# Altium schematic sheet Temp_Measurements.SchDoc
size A4; CompanyName: Technische Hochschule Nürnberg Georg Simon Ohm; Organization: UltraZohm; Address1: Kesslerplatz 12; Address2: 90489 Nürnberg; Address3: GERMANY; SheetNumber: 8; SheetTotal: 9; Website: www.ultrazohm.com
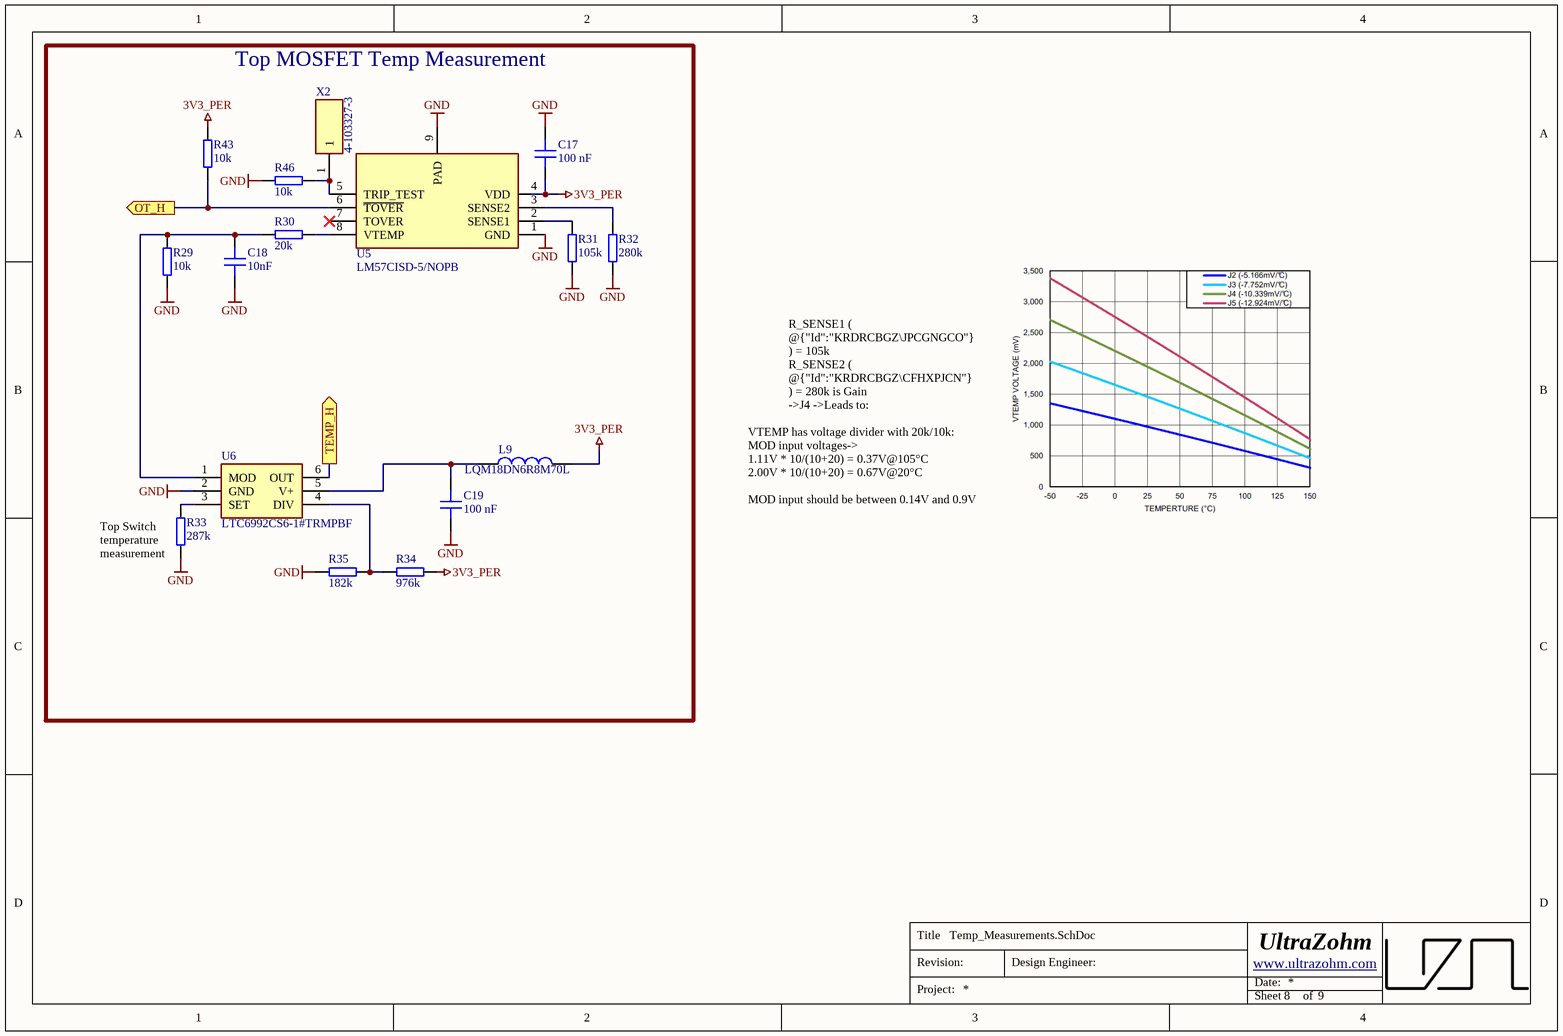
[diagram p0: Temp_Measurements.SchDoc]

## Parts
C17  100 nF  [C_0603]
C18  10nF  [C_0603]
C19  100 nF  [C_0603]
L9  LQM18DN6R8M70L  [INDC1608X95N]
R29  10k  [RES 0603_1608]
R30  20k  [RES 0603_1608]
R31  105k  [RES 0603_1608]
R32  280k  [RES 0603_1608]
R33  287k  [RES 0805_2012]
R34  976k  [RES 0603_1608]
R35  182k  [RES 0603_1608]
R43  10k  [RES 0603_1608]
R46  10k  [RES 0603_1608]
U5  LM57CISD-5/NOPB  [SON50P250X250X80-9N]
U6  LTC6992CS6-1#TRMPBF  [SOT95P280X100-6N]
X2  4-103327-3  [1_Pin_Header]

## Blocks framed on the sheet
Top MOSFET Temp Measurement: C17-C19 L9 R29-R35 R43 R46 U5 U6 X2

## Ports
OT_H (out), TEMP_H (out)

## Nets
3V3_PER: C17.1 L9.2 R34.2 R43.1 U5.4(VDD)
GND: C17.2 C18.1 C19.1 R29.2 R31.1 R32.1 R33.1 R35.1 R46.2 U5.1(GND) U5.9(PAD) U6.2(GND)
OT_H: R43.2 U5.6(~{TOVER}) ; port OT_H
TEMP_H: U6.6(OUT) ; port TEMP_H
NetC18_2: C18.2 R29.1 R30.1 U6.1(MOD)
NetC19_2: C19.2 L9.1 U6.5(V+)
NetR30_2: R30.2 U5.8(VTEMP)
NetR31_2: R31.2 U5.2(SENSE1)
NetR32_2: R32.2 U5.3(SENSE2)
NetR33_2: R33.2 U6.3(SET)
NetR34_1: R34.1 R35.2 U6.4(DIV)
NetR46_1: R46.1 U5.5(TRIP_TEST) X2.1

Not connected (* = marked no-connect by the designer): U5 7(TOVER)*

## Notes on the sheet
- R_SENSE1 ( @{"Id":"KRDRCBGZ\JPCGNGCO"} ) = 105k
  R_SENSE2 ( @{"Id":"KRDRCBGZ\CFHXPJCN"} ) = 280k is Gain
  ->J4 ->Leads to:
  1.11V@105°C
  2.00V@20°C
  /TOVER trips at 105°C
- VTEMP has voltage divider with 20k/10k:
  MOD input voltages->
  1.11V * 10/(10+20) = 0.37V@105°C
  2.00V * 10/(10+20) = 0.67V@20°C
  MOD input should be between 0.14V and 0.9V
- (near R33) Top Switch temperature measurement
- Title
- Revision:
- Design Engineer:
- Date:
- Project:
- Sheet
- of

## Library data of the parts
C17 C19 = C1608X7S2A104KT000N: 100V 100nF X7S ±10% 0603 Multilayer Ceramic Capacitors MLCC - SMD/SMT ROHS; Manufacturer: TDK; Voltage Rating: 100 VDC; Created from: AGeiger; Manufacturer Part Number: C1608X7S2A104KT000N; PartID: 148; Created On: 20.12.2020 13:54:13; ComponentLink1Description: Datasheet; ComponentLink1URL: https://datasheet.lcsc.com/lcsc/2304140030_TDK-C1608X7S2A104KT000N_C343025.pdf; Component Type: Capacitor 0603; Device Package: 0603; Last Updated: 14.12.2022 12:14:21; Mounting Type: SMD; Operating Temperature: -55 to 125°C; Series: X7R; Supplier 1: LCSC; Supplier Part Number 1: C343025; Type: Capacitor; Tolerance: 10 %; Value: 100 nF; Live Cycle Status: 1; Stock number: not stored; LCSC Part Number: C343025
C18 = CT41G-0603-2X1-50V-0.01μF-K(N): 50V 10nF 2X1 ±10%; Manufacturer: TORCH; Voltage Rating: 50 VDC; Created from: KIlhan; Manufacturer Part Number: CT41G-0603-2X1-50V-0.01μF-K(N); PartID: 130; Created On: 05.07.2023 18:57:50; ComponentLink1Description: Datasheet; ComponentLink1URL: https://datasheet.lcsc.com/lcsc/1809291621_TORCH-CT41G-0603-2X1-50V-0-01-F-K-N_C136131.pdf; Component Type: Capacitor 0603; Device Package: 0603; Last Updated: 05.07.2023 18:57:50; Mounting Type: SMD; Operating Temperature: -55 - 125°C; Supplier 1: LCSC; Supplier Part Number 1: C136131; Type: Capacitor; Tolerance: 10 %; Value: 10nF; Live Cycle Status: 1; Stock number: not stored; LCSC Part Number: C136131
L9 = LQM18DN6R8M70L: 6.8µH, 120mA, 0603, 740mOhm, 20%; Manufacturer: Murata; MF: EPCOS / TDK; Value: 6.8uH; DCR: 320m; Rated Current: 0.85 A; Type: fixed inductor; Created from: DHufnagel; MPN: B82464G4154M; Supplier 1: Mouser; Supplier Part Number 1: 81-LQM18DN6R8M70L; Manufacturer Part Number: LQM18DN6R8M70L; PartID: 10; Created On: 19.07.2022 15:47:17; ComponentLink1Description: Datasheet; ComponentLink1URL: https://www.mouser.de/datasheet/2/281/1/JELF243B_0086-2298241.pdf; Component Type: SMD fixed inductor; Device Package: SMD; Last Updated: 15.06.2023 16:03:16; Mounting Type: SMD; Operating Temperature: -40 - 125°C; Series: LQM18DN_70; Supplier 2: Digi-Key; Supplier Part Number 2: 490-LQM18DN6R8M70LCT-ND; DC current: 120mA; Live Cycle Status: 1; Stock number: not stored; LCSC Part Number: C1881372
R29 R43 R46 = RK73B1JTTD103J: SMD resistor E24 series; Manufacturer: KOA Speer; Tolerance: 5%; Created from: MGremer; Manufacturer Part Number: RK73B1JTTD103J; PartID: 98; Created On: 14.12.2020 16:17:14; ComponentLink1Description: Datasheet; ComponentLink1URL: https://www.mouser.de/datasheet/2/219/RK73B-1825463.pdf; Component Type: SMD resistor; Device Package: 0603; Last Updated: 27.05.2022 14:04:22; Mounting Type: SMD; Supplier 1: Mouser; Supplier Part Number 1: 660-RK73B1JTTD103J; Type: Resistor; Value: 10k; Live Cycle Status: 1; Stock number: Labor SMD Container; LCSC Part Number: C25804
R30 = RK73B1JTTD203J: SMD resistor E24 series; Manufacturer: KOA Speer; Tolerance: 5%; Created from: MGremer; Manufacturer Part Number: RK73B1JTTD203J; PartID: 105; Created On: 14.12.2020 16:17:14; ComponentLink1Description: Datasheet; ComponentLink1URL: https://www.mouser.de/datasheet/2/219/RK73B-1825463.pdf; Component Type: SMD resistor; Device Package: 0603; Last Updated: 27.05.2022 13:42:48; Mounting Type: SMD; Supplier 1: Mouser; Supplier Part Number 1: 660-RK73B1JTTD203J; Type: Resistor; Value: 20k; Live Cycle Status: 1; Stock number: Labor SMD Container; LCSC Part Number: C4184
R31 = CR0603-FX-1053ELF: SMD resistor 1%, 50V, 100ppm; Manufacturer: Bourns; Created from: DHufnagel; Manufacturer Part Number: CR0603-FX-1053ELF; PartID: 232; Created On: 25.07.2022 08:26:35; ComponentLink1Description: Datasheet; ComponentLink1URL: https://www.mouser.de/datasheet/2/54/cr-1858361.pdf; Component Type: SMD resistor; Device Package: 0603; Last Updated: 21.02.2024 16:03:36; Mounting Type: SMD; Supplier 1: Mouser; Supplier Part Number 1: 652-CR0603-FX1053ELF; Type: Resistor; Tolerance: 1%; Value: 105k; Live Cycle Status: 1; Stock number: not stored; Supplier 2: LCSC; Supplier Part Number 2: C141685; LCSC Part Number: C141685
R32 = CR0603-FX-2803ELF: SMD resistor 1%, 50V, 100ppm; Manufacturer: Bourns; Created from: DHufnagel; Manufacturer Part Number: CR0603-FX-2803ELF; PartID: 233; Created On: 25.07.2022 08:26:35; ComponentLink1Description: Datasheet; ComponentLink1URL: https://www.mouser.de/datasheet/2/54/cr-1858361.pdf; Component Type: SMD resistor; Device Package: 0603; Last Updated: 21.02.2024 16:06:06; Mounting Type: SMD; Supplier 1: Mouser; Supplier Part Number 1: 652-CR0603-FX2803ELF; Type: Resistor; Tolerance: 1%; Value: 280k; Live Cycle Status: 1; Stock number: not stored; Supplier 2: LCSC; Supplier Part Number 2: C861797; LCSC Part Number: C861797
R33 = ERJ-6ENF2873V: SMD resistor 1%; Manufacturer: Panasonic; Created from: MGremer; Manufacturer Part Number: ERJ-6ENF2873V; PartID: 154; Created On: 14.12.2020 16:17:14; ComponentLink1Description: Datasheet; ComponentLink1URL: https://www.mouser.de/datasheet/2/315/AOA0000C304-1149620.pdf; Component Type: SMD resistor; Device Package: 0805; Last Updated: 15.02.2023 18:07:29; Mounting Type: SMD; Supplier 1: Mouser; Supplier Part Number 1: 667-ERJ-6ENF2873V; Type: Resistor; Tolerance: 1%; Value: 287k; Live Cycle Status: 1; Stock number: not stored; LCSC Part Number: C228683
R34 = CR0603-FX-9763ELF: SMD resistor 1%, 50V, 100ppm; Manufacturer: Bourns; Created from: DHufnagel; Manufacturer Part Number: CR0603-FX-9763ELF; PartID: 234; Created On: 25.07.2022 08:26:35; ComponentLink1Description: Datasheet; ComponentLink1URL: https://www.mouser.de/datasheet/2/54/cr-1858361.pdf; Component Type: SMD resistor; Device Package: 0603; Last Updated: 15.02.2023 18:14:05; Mounting Type: SMD; Supplier 1: Mouser; Supplier Part Number 1: 652-CR0603FX-9763ELF; Type: Resistor; Tolerance: 1%; Value: 976k; Live Cycle Status: 1; Stock number: not stored; LCSC Part Number: C162980
R35 = CR0603-FX-1823ELF: SMD resistor 1%, 50V, 100ppm; Manufacturer: Bourns; Created from: DHufnagel; Manufacturer Part Number: CR0603-FX-1823ELF; PartID: 235; Created On: 25.07.2022 08:26:35; ComponentLink1Description: Datasheet; ComponentLink1URL: https://www.mouser.de/datasheet/2/54/cr-1858361.pdf; Component Type: SMD resistor; Device Package: 0603; Last Updated: 15.02.2023 18:09:14; Mounting Type: SMD; Supplier 1: Mouser; Supplier Part Number 1: 652-CR0603FX-1823ELF; Type: Resistor; Tolerance: 1%; Value: 182k; Live Cycle Status: 1; Stock number: not stored; LCSC Part Number: C203368
U5 = LM57CISD-10/NOPB: Board Mount Temperature Sensor, -50 - 150°C; Manufacturer: Texas Instruments; Created from: DHufnagel; Manufacturer Part Number: LM57CISD-5/NOPB; PartID: 5; Created On: 30.06.2022 08:21:10; ComponentLink1Description: Datasheet; ComponentLink1URL: https://www.ti.com/general/docs/suppproductinfo.tsp?distId=26&gotoUrl=https://www.ti.com/lit/gpn/lm57; Component Type: Temperature Sensors; Device Package: WSON-8; Last Updated: 14.06.2023 22:16:01; Mounting Type: SMD; Operating Temperature: -50 - 150°C; Supplier 1: Mouser; Supplier Part Number 1: 926-LM57CISD-5/NOPB; Supplier 2: Digi-Key; Supplier Part Number 2: LM57CISD-5/NOPBCT-ND; Type: Temperature Sensor; Live Cycle Status: 1; Stock number: not stored; LCSC Part Number: C2864092
U6 = LTC6992CS6-1#TRMPBF: Switching Controllers PWM with 0% to 100% Pulse Width Control; Manufacturer: Analog Devices; Created from: AGeiger; Manufacturer Part Number: LTC6992CS6-1#TRMPBF; PartID: 11; Created On: 20.07.2022 14:30:26; ComponentLink1Description: Datasheet; ComponentLink1URL: https://www.mouser.de/datasheet/2/609/LTC6992-1-6992-2-6992-3-6992-4-1852873.pdf; Component Type: Switching Controllers; Device Package: SOT-23-6; Last Updated: 14.06.2023 22:16:01; Mounting Type: SMD; Operating Temperature: 0 to 70 °C; Supplier 1: Mouser; Supplier Part Number 1: 584-C6992CS6-1TRMPBF; Type: Switching Controller; Live Cycle Status: 1; Stock number: not stored; Supplier 2: LCSC; Supplier Part Number 2: C581034; LCSC Part Number: C581034
X2 = 4-103327-3: Pin Header, 2.54mm, 1 Pin; Manufacturer: TE Connectivity; Created from: DHufnagel; Number of positions: 1; Manufacturer Part Number: 4-103327-3; PartID: 12; Created On: 18.08.2022 09:37:37; ComponentLink1Description: Datasheet; ComponentLink1URL: https://www.mouser.de/datasheet/2/418/NG_CD_103327_T_baseFilename-749242.pdf; Component Type: Pin Header; Device Package: THT; Last Updated: 18.08.2022 09:41:31; Mounting Type: THT; Operating Temperature: -65 - 105 °C; Series: AMPMODU MOD II; Supplier 1: Mouser; Supplier Part Number 1: 571-4-103327-3; Type: Pin Header; Live Cycle Status: 1; Stock number: not stored; Number of rows: 1